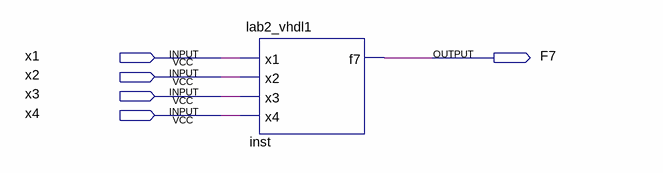
[diagram p0: schematic sheet]
// Quartus schematic lab2_block1.bdf as structural Verilog: 1 symbols, 5 pins
module lab2_block1 (
  input  x1,
  input  x2,
  input  x3,
  input  x4,
  output F7
);

  lab2_vhdl1 inst (.x1(x1), .x2(x2), .x3(x3), .x4(x4), .f7(F7));
endmodule
